# EAGLE board Main_Board_Rev_A2 (EAGLE 7.7.0)
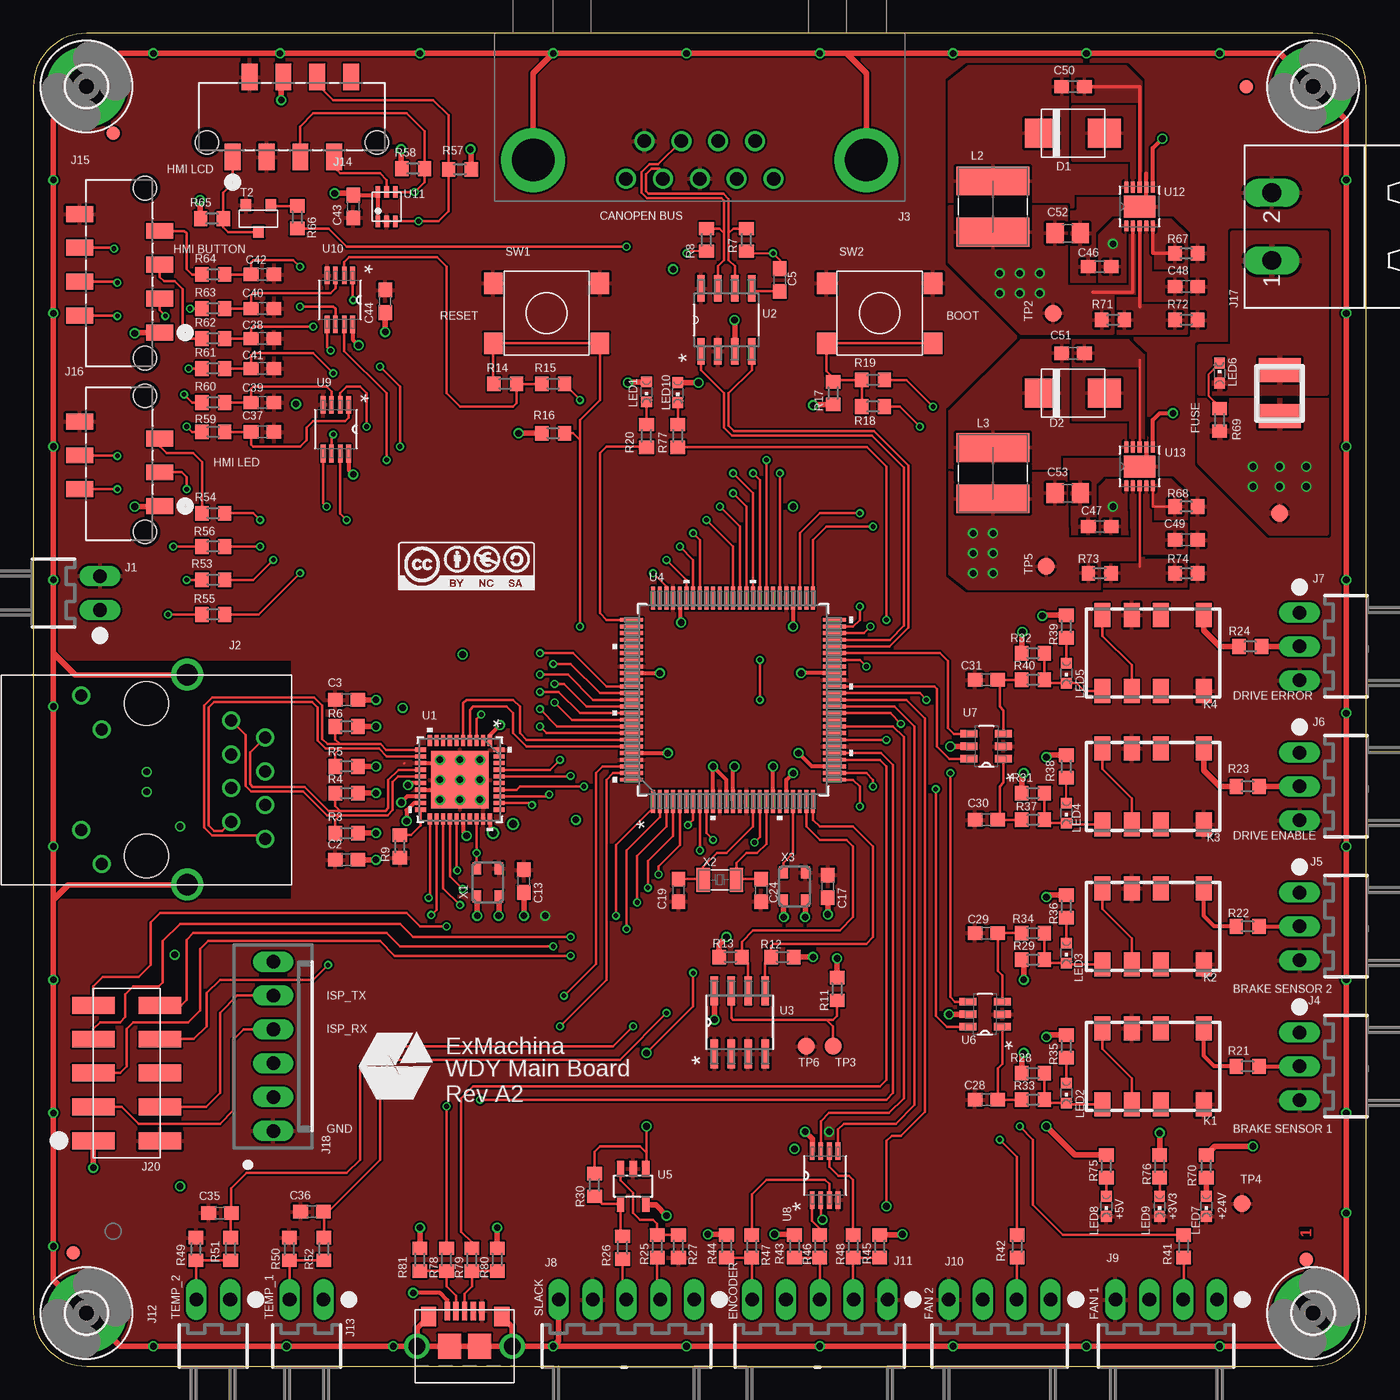
[diagram p6: board, top side]
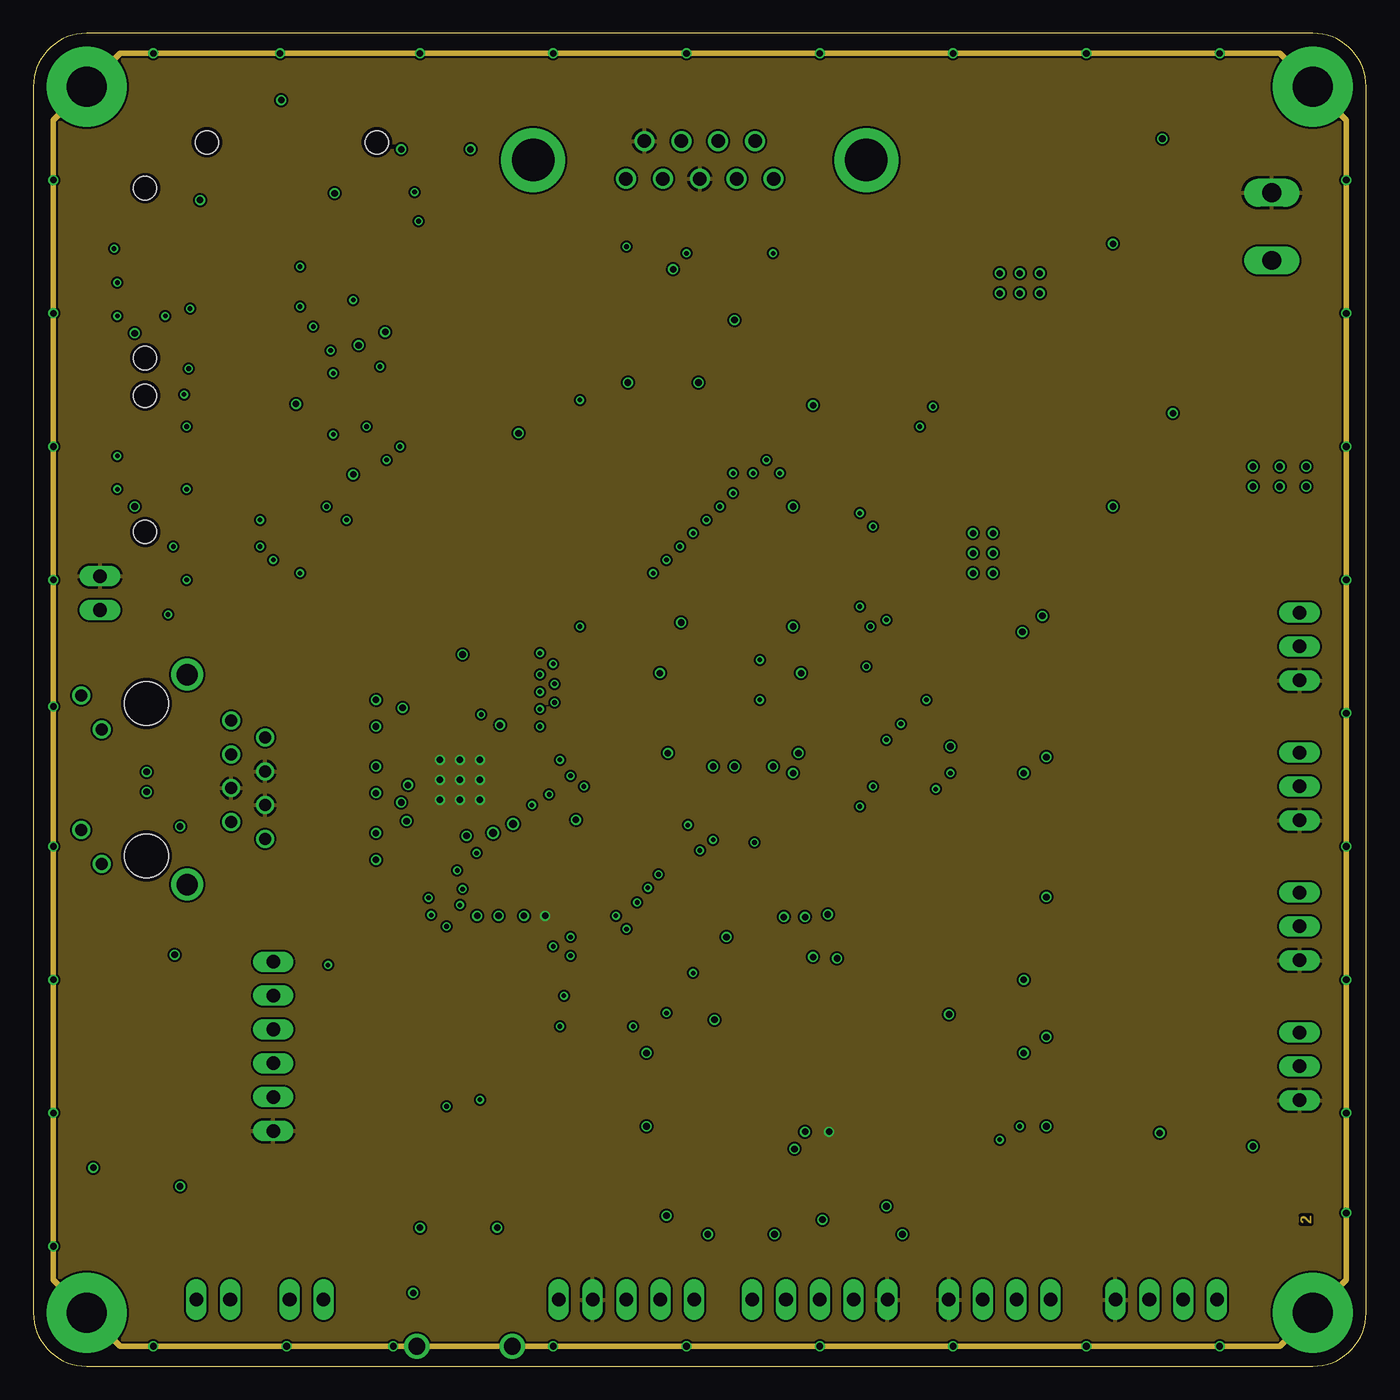
[diagram p7: board, inner layer Route2]
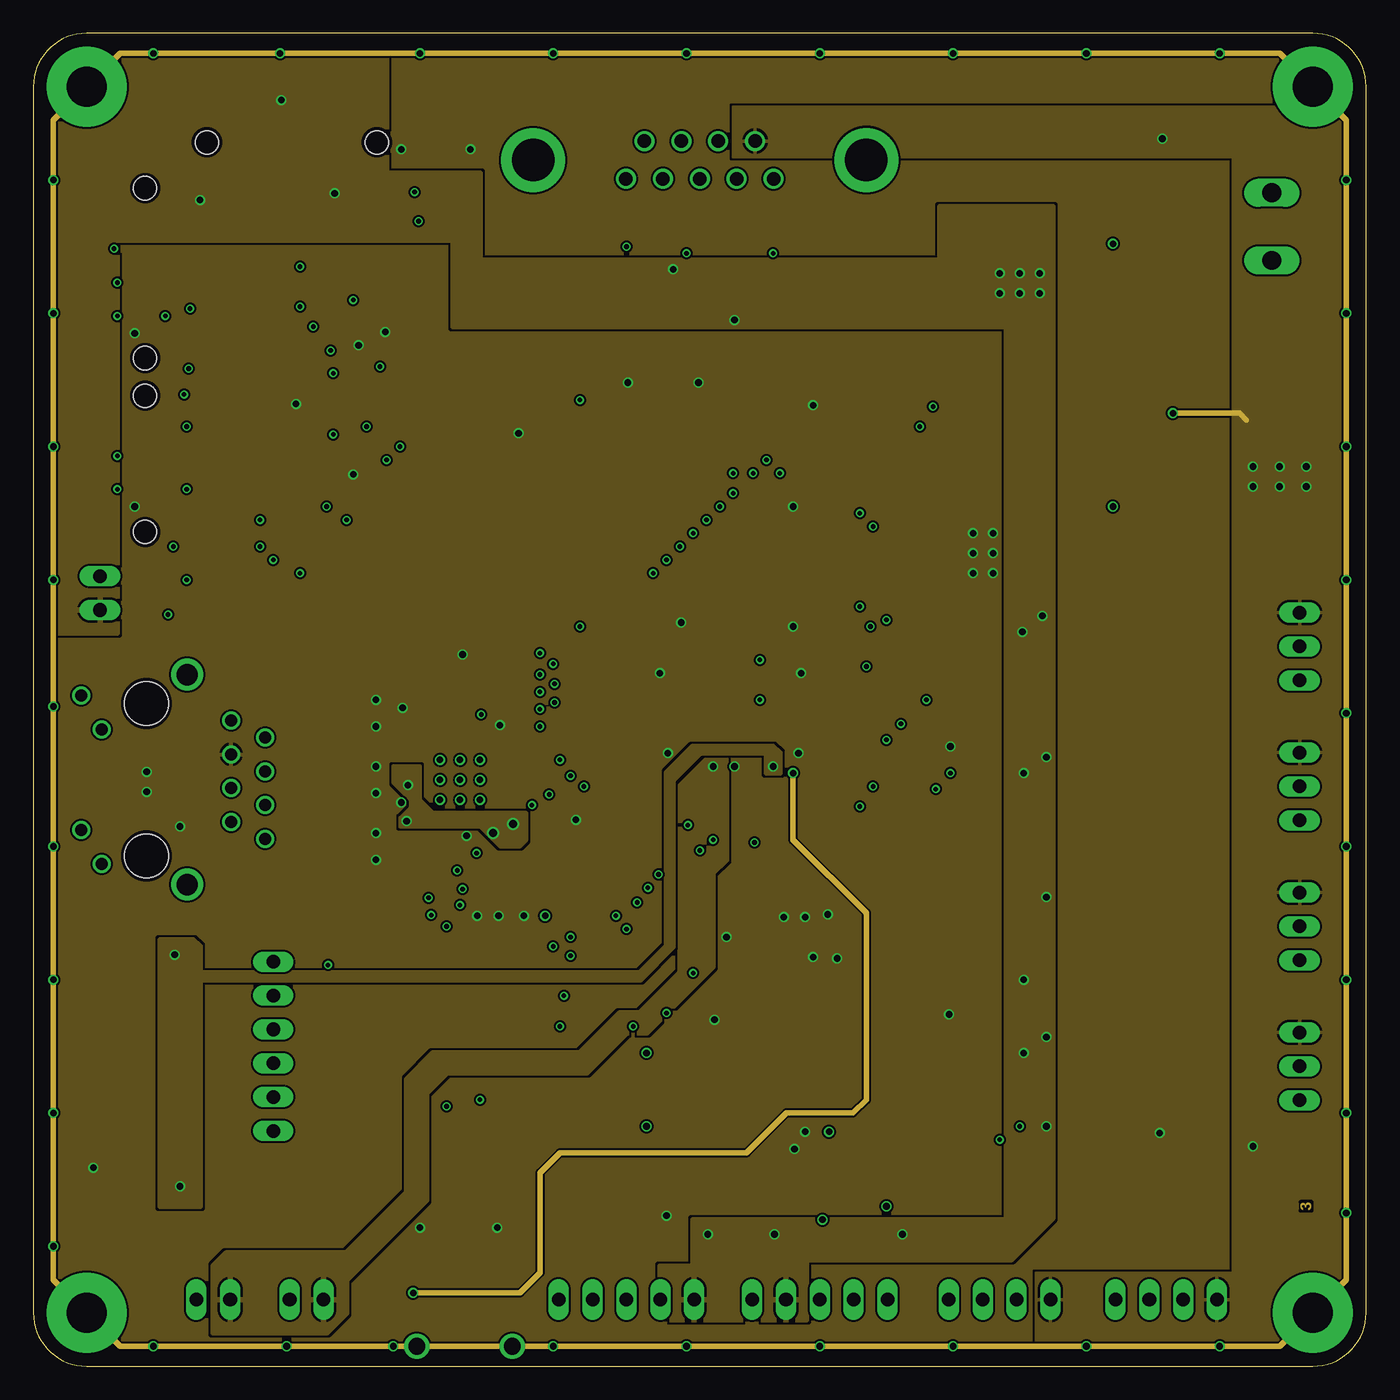
[diagram p8: board, inner layer Route15]
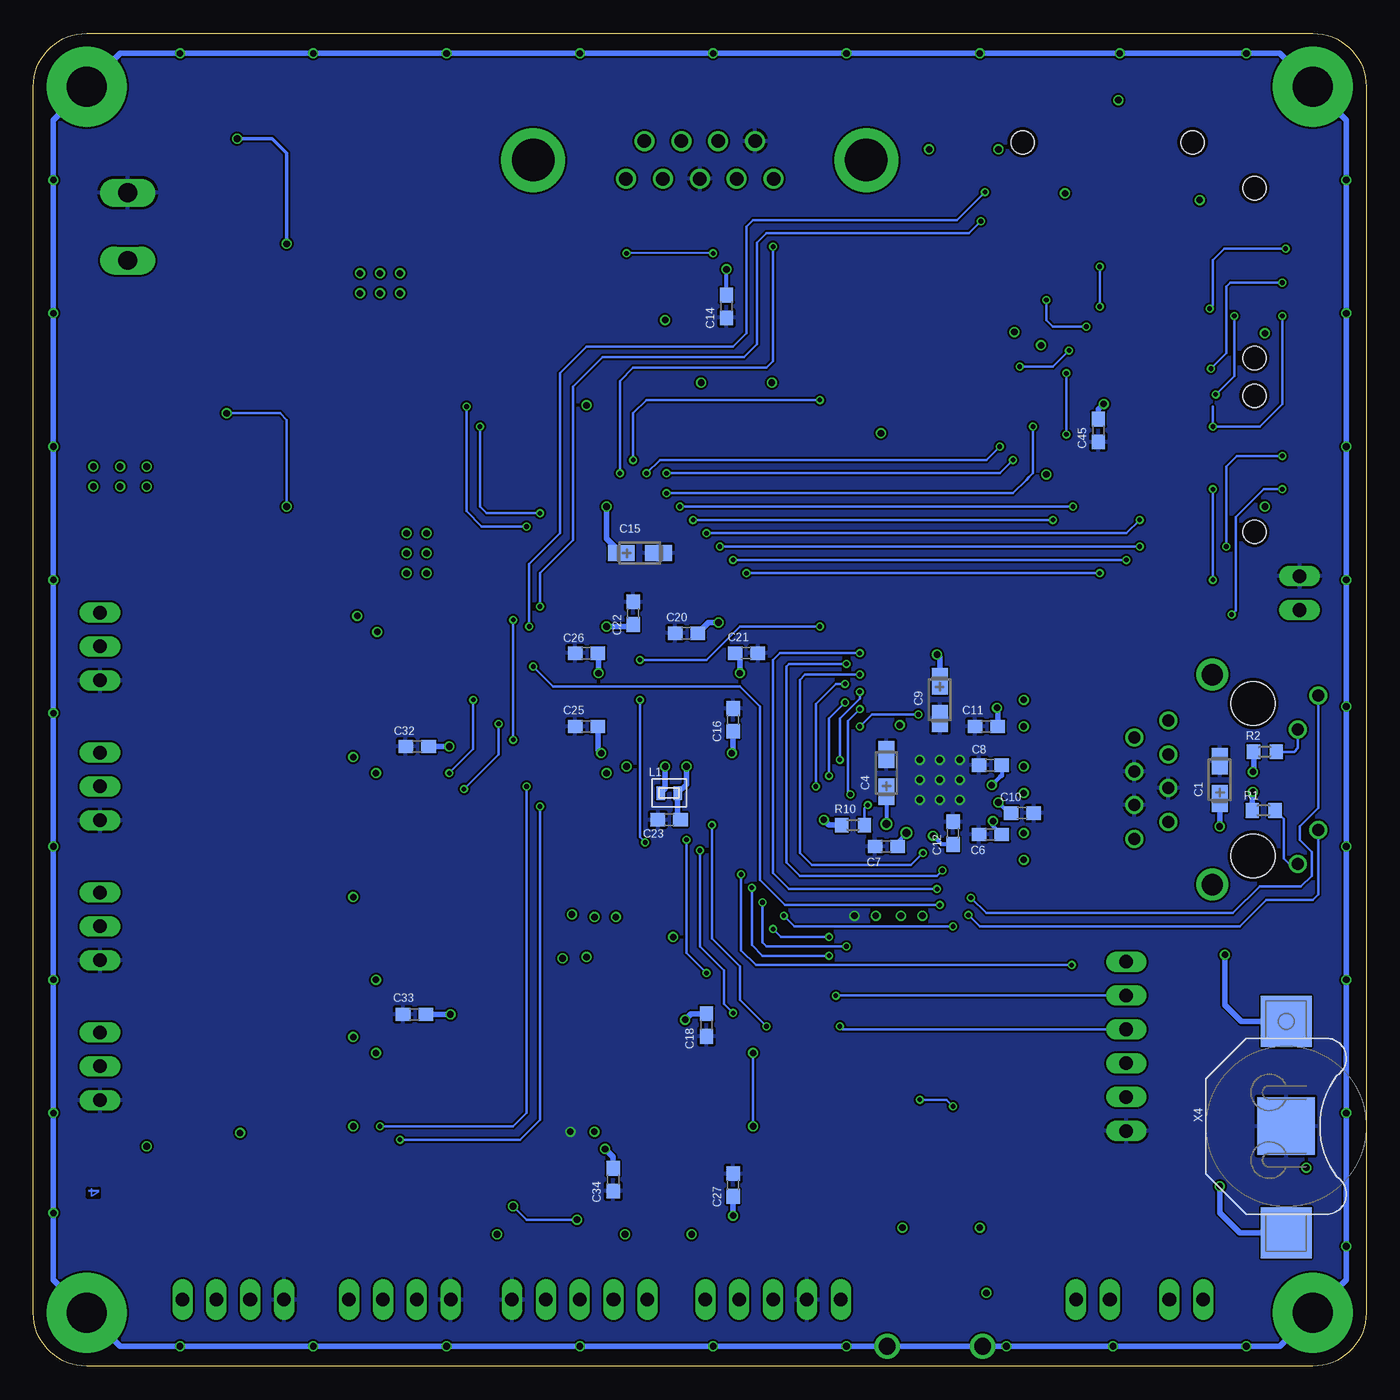
[diagram p9: board, bottom side, seen from below]

Size 100 x 100 mm. Coordinates in mm from the lower left corner, seen from the top.
Outline: 0,96 0,4 arc90 4,0 96,0 arc90 100,4 100,96 arc90 96,100 4,100 arc90 0,96
Copper layers (1+2*15+16): Top 0.018mm / dielectric 0.36mm / Route2 0.035mm / dielectric 0.71mm / Route15 0.035mm / dielectric 0.2mm / Bottom 0.018mm
Design rules "eC_4Layer_PClass6_BaseCopperO18-I35_eCDefault *": minimum track width 0.15mm, minimum drill 0.35mm, track to track 0.15mm, track to pad 0.15mm, pad to pad 0.15mm, via to via 0.15mm, smd to smd 0mil, copper to edge 0.25mm, drill to drill 0.35mm, minimum pad ring 0.175mm, minimum via ring 0.125mm, stop-mask expansion 0mil, vias tented up to drill 0.5mm, thermal gap 0.2mm
Net classes: 1 signal: width 0.178 mm, drill 0.35 mm; 2 supply: width 0.008 mm, drill 0.5 mm

## Footprints (pad centres in the part's own frame; a part is rotated, then mirrored left to right if it is on the bottom)
CT3216 = smd 2 x 1.2: + -1.4,0; - 1.4,0
C0603 = smd 1.1 x 1: 1 -0.85,0; 2 0.85,0
C0805 = smd 1.3 x 1.5: 1 -0.95,0; 2 0.95,0
DO-214AA = smd 2.5 x 2.2: A 2.35,0; C -2.35,0
LITTLEFUSE_SMD = smd 1.78 x 3.15: 1 -1.725,0; 2 1.725,0
7395-02 = drill 1.016 long: 1 1.27,0; 2 -1.27,0
WIZNET_RB1-125BAG1A = drill 0.9: L1 6.325,-3.38; L2 3.784,-4.899; L3 -3.786,-3.379; L4 -6.325,-4.9 | drill 0.9 pad 1.3: R1 -4.446,6.349; R2 -3.176,8.889; R3 -1.906,6.349; R4 -0.636,8.889; R5 0.634,6.349; R6 1.904,8.889; R7 3.174,6.349; R8 4.444,8.889 | drill 1.6 pad 2.184: S1 -7.876,3.049; S2 7.874,3.049 | hole 3.3: 5.714,-0.001; -5.716,-0.001
5504F1-09S-02A = drill 1: 1 -5.54,-1.42; 2 -2.77,-1.42; 3 0,-1.42; 4 2.77,-1.42; 5 5.54,-1.42; 6 -4.155,1.42; 7 -1.385,1.42; 8 1.385,1.42; 9 4.155,1.42 | drill 3.2: G1 -12.495,0; G2 12.495,0
7395-03 = drill 1.016 long: 1 2.54,0; 2 0,0; 3 -2.54,0
7395-05 = drill 1.016 long: 1 5.08,0; 2 2.54,0; 3 0,0; 4 -2.54,0; 5 -5.08,0
7395-04 = drill 1.016 long: 1 3.81,0; 2 1.27,0; 3 -1.27,0; 4 -3.81,0
MOLEX_90814-0208 = smd 1.194 x 2.007: 1 -4.445,-3.175; 2 -3.175,2.819; 3 -1.905,-3.175; 4 -0.635,2.819; 5 0.635,-3.175; 6 1.905,2.819; 7 3.175,-3.175; 8 4.445,2.819 | hole 1.753: -6.375,-2.083; 6.375,-2.083
MOLEX_90814-0206 = smd 1.194 x 2.007: 1 -3.175,-3.175; 2 -1.905,2.819; 3 -0.635,-3.175; 4 0.635,2.819; 5 1.905,-3.175; 6 3.175,2.819 | hole 1.753: -5.105,-2.083; 5.105,-2.083
MSTBA2 = drill 1.397 long: 1 -2.54,5.08; 2 2.54,5.08
6410-06 = drill 1.016 long: 1 6.35,0; 2 3.81,0; 3 1.27,0; 4 -1.27,0; 5 -3.81,0; 6 -6.35,0
USB_MICROB_SMT = smd 0.4 x 1.4: 1 -1.3,2.65; 2 -0.65,2.65; 3 0,2.65; 4 0.65,2.65; 5 1.3,2.65 | smd 1.15 x 1.45: 7 -2.7,2.23; 8 2.8,2.23 | smd 1.75 x 1.9: 9 -1.125,0; 10 1.125,0 | drill 1.25 pad 1.9: 11 -3.575,0; 12 3.575,0
2.54/2X5 = smd 1.27 x 3.2: 1 -5.08,2.5; 2 -5.08,-2.5; 3 -2.54,2.5; 4 -2.54,-2.5; 5 0,2.5; 6 0,-2.5; 7 2.54,2.5; 8 2.54,-2.5; 9 5.08,2.5; 10 5.08,-2.5
FIDUCIAL-1X2 = smd 1 x 1: 1 0,0
G6K-2G-Y = smd 1.2 x 1.8: 1 -3.8,-2.85; 2 -0.6,-2.85; 3 1.6,-2.85; 4 3.8,-2.85; 5 3.8,2.85; 6 1.6,2.85; 7 -0.6,2.85; 8 -3.8,2.85
0603 = smd 0.64 x 1.02: P$1 -0.64,0; P$2 0.64,0
WE-PD2_5848/5820 = smd 2.15 x 5.5: 1 -1.925,0; 2 1.925,0
CHIPLED_0603 = smd 0.8 x 0.8: A 0,-0.75; C 0,0.75
P3,0 = drill 3 pad 6: 1 0,0
R0603 = smd 1 x 1.1: 1 -0.85,0; 2 0.85,0
B3FS = smd 1.4 x 1.6: 1 4,-2.25; 2 -4,-2.25; 3 4,2.25; 4 -4,2.25
SOT−23 = smd 0.787 x 0.889: 1 0.94,1.003; 2 -0.94,1.003; 3 0,-1.003
B1,27 = smd 1.27 x 1.27: TP 0,0
SQA40B = smd 0.813 x 0.305: 1 -2.946,2.25; 2 -2.946,1.75; 3 -2.946,1.25; 4 -2.946,0.75; 5 -2.946,0.25; 6 -2.946,-0.25; 7 -2.946,-0.75; 8 -2.946,-1.25; 9 -2.946,-1.75; 10 -2.946,-2.25; 21 2.946,-2.25; 22 2.946,-1.75; 23 2.946,-1.25; 24 2.946,-0.75; 25 2.946,-0.25; 26 2.946,0.25; 27 2.946,0.75; 28 2.946,1.25; 29 2.946,1.75; 30 2.946,2.25 | smd 0.305 x 0.813: 11 -2.25,-2.946; 12 -1.75,-2.946; 13 -1.25,-2.946; 14 -0.75,-2.946; 15 -0.25,-2.946; 16 0.25,-2.946; 17 0.75,-2.946; 18 1.25,-2.946; 19 1.75,-2.946; 20 2.25,-2.946; 31 2.25,2.946; 32 1.75,2.946; 33 1.25,2.946; 34 0.75,2.946; 35 0.25,2.946; 36 -0.25,2.946; 37 -0.75,2.946; 38 -1.25,2.946; 39 -1.75,2.946; 40 -2.25,2.946 | smd 4.3 x 4.3: 41 0,0
SOIC127P600X175-8N = smd 1.981 x 0.559: 1 -2.362,1.905; 2 -2.362,0.635; 3 -2.362,-0.635; 4 -2.362,-1.905; 5 2.362,-1.905; 6 2.362,-0.635; 7 2.362,0.635; 8 2.362,1.905
SOIC127P600X175-8N' = smd 2.184 x 0.559: 1 -2.362,1.905; 2 -2.362,0.635; 3 -2.362,-0.635; 4 -2.362,-1.905; 5 2.362,-1.905; 6 2.362,-0.635; 7 2.362,0.635; 8 2.362,1.905
SOT407-1 = smd 1.727 x 0.279: 1 -7.62,6; 2 -7.62,5.5; 3 -7.62,5; 4 -7.62,4.5; 5 -7.62,4; 6 -7.62,3.5; 7 -7.62,3; 8 -7.62,2.5; 9 -7.62,2; 10 -7.62,1.5; 11 -7.62,1; 12 -7.62,0.5; 13 -7.62,0; 14 -7.62,-0.5; 15 -7.62,-1; 16 -7.62,-1.5; 17 -7.62,-2; 18 -7.62,-2.5; 19 -7.62,-3; 20 -7.62,-3.5; 21 -7.62,-4; 22 -7.62,-4.5; 23 -7.62,-5; 24 -7.62,-5.5; 25 -7.62,-6; 51 7.62,-6; 52 7.62,-5.5; 53 7.62,-5; 54 7.62,-4.5; 55 7.62,-4; 56 7.62,-3.5; 57 7.62,-3; 58 7.62,-2.5; 59 7.62,-2; 60 7.62,-1.5; 61 7.62,-1; 62 7.62,-0.5; 63 7.62,0; 64 7.62,0.5; 65 7.62,1; 66 7.62,1.5; 67 7.62,2; 68 7.62,2.5; 69 7.62,3; 70 7.62,3.5; 71 7.62,4; 72 7.62,4.5; 73 7.62,5; 74 7.62,5.5; 75 7.62,6 | smd 0.279 x 1.727: 26 -6,-7.62; 27 -5.5,-7.62; 28 -5,-7.62; 29 -4.5,-7.62; 30 -4,-7.62; 31 -3.5,-7.62; 32 -3,-7.62; 33 -2.5,-7.62; 34 -2,-7.62; 35 -1.5,-7.62; 36 -1,-7.62; 37 -0.5,-7.62; 38 0,-7.62; 39 0.5,-7.62; 40 1,-7.62; 41 1.5,-7.62; 42 2,-7.62; 43 2.5,-7.62; 44 3,-7.62; 45 3.5,-7.62; 46 4,-7.62; 47 4.5,-7.62; 48 5,-7.62; 49 5.5,-7.62; 50 6,-7.62; 76 6,7.62; 77 5.5,7.62; 78 5,7.62; 79 4.5,7.62; 80 4,7.62; 81 3.5,7.62; 82 3,7.62; 83 2.5,7.62; 84 2,7.62; 85 1.5,7.62; 86 1,7.62; 87 0.5,7.62; 88 0,7.62; 89 -0.5,7.62; 90 -1,7.62; 91 -1.5,7.62; 92 -2,7.62; 93 -2.5,7.62; 94 -3,7.62; 95 -3.5,7.62; 96 -4,7.62; 97 -4.5,7.62; 98 -5,7.62; 99 -5.5,7.62; 100 -6,7.62
SOT23-DBV = smd 0.55 x 1.2: 1 -0.95,-1.3; 2 0,-1.3; 3 0.95,-1.3; 4 0.95,1.3; 5 -0.95,1.3
SOT95P280X145-6N = smd 1.27 x 0.559: 1 -1.295,0.94; 2 -1.295,0; 3 -1.295,-0.94; 4 1.295,-0.94; 5 1.295,0; 6 1.295,0.94
SOP65P400X130-8N = smd 1.321 x 0.356: 1 -1.829,0.965; 2 -1.829,0.33; 3 -1.829,-0.33; 4 -1.829,-0.965; 5 1.829,-0.965; 6 1.829,-0.33; 7 1.829,0.33; 8 1.829,0.965
SC-70-DCK = smd 0.35 x 0.85: 1 -0.65,-1.1; 2 0,-1.1; 3 0.65,-1.1; 4 0.65,1.1; 5 0,1.1; 6 -0.65,1.1
DFN300X300X80-11N = smd 0.813 x 0.305: 1 -1.448,0.991; 2 -1.448,0.508; 3 -1.448,0; 4 -1.448,-0.508; 5 -1.448,-0.991; 6 1.448,-0.991; 7 1.448,-0.508; 8 1.448,0; 9 1.448,0.508; 10 1.448,0.991 | smd 1.651 x 2.388: 11 0,0
ASE = smd 0.9 x 0.65: 1 -1.05,-0.825; 2 1.05,-0.825; 3 1.05,0.825; 4 -1.05,0.825
FC-135 = smd 1 x 1.8: 1 -1.25,0; 2 1.25,0
3000 = smd 3.81 x 3.81: +1 -7.874,0; +2 8.001,0 | smd 4.318 x 4.318: - 0,0

## Placement (x,y rotation side)
C1  4.7uF  [CT3216]  11,44 90 bottom
C2  100nF  [C0603]  23.5,38 180 top
C3  100nF  [C0603]  23.5,50 180 top
C4  10uF  [CT3216]  36,44.5 90 bottom
C5  4700pF  [C0603]  56,81.5 270 top
C6  100nF  [C0603]  28.2,39.9 180 bottom
C7  100nF  [C0603]  36,39 180 bottom
C8  100nF  [C0603]  28.2,45.1 180 bottom
C9  10uF  [CT3216]  32,50 270 bottom
C10  100nF  [C0603]  25.8,41.5 0 bottom
C11  100nF  [C0603]  28.5,48 180 bottom
C12  100nF  [C0603]  31,40 90 bottom
C13  100nF  [C0603]  36.8,36.4 90 top
C14  100nF  [C0603]  48,79.5 270 bottom
C15  10uF  [CT3216]  54.5,61 0 bottom
C16  0.1uF  [C0603]  47.5,48.5 90 bottom
C17  0.1uF  [C0603]  59.6,36 90 top
C18  0.1uF  [C0603]  49.5,25.6 270 bottom
C19  18pF  [C0603]  48.4,35.7 270 top
C20  0.1uF  [C0603]  51,55 180 bottom
C21  0.1uF  [C0603]  46.5,53.5 0 bottom
C22  0.1uF  [C0603]  55,56.5 90 bottom
C23  0.1uF  [C0603]  52.3,41 180 bottom
C24  18pF  [C0603]  54.6,35.7 270 top
C25  0.1uF  [C0603]  58.5,48 180 bottom
C26  0.1uF  [C0603]  58.5,53.5 180 bottom
C27  0.1uF  [C0603]  47.5,13.6 90 bottom
C28  0.1uF  [C0603]  71.5,20 180 top
C29  0.1uF  [C0603]  71.5,32.5 180 top
C30  0.1uF  [C0603]  71.5,41 180 top
C31  0.1uF  [C0603]  71.5,51.5 180 top
C32  0.1uF  [C0603]  71.2,46.5 180 bottom
C33  0.1uF  [C0603]  71.4,26.4 180 bottom
C34  0.1uF  [C0603]  56.5,14 270 bottom
C35  4.7uF  [C0603]  14,11.5 180 top
C36  4.7uF  [C0603]  20.9,11.6 180 top
C37  0.1uF  [C0603]  17.2,70.1 0 top
C38  0.1uF  [C0603]  17.2,77.1 0 top
C39  0.1uF  [C0603]  17.2,72.3 0 top
C40  0.1uF  [C0603]  17.2,79.35 0 top
C41  0.1uF  [C0603]  17.2,74.85 0 top
C42  0.1uF  [C0603]  17.2,81.9 0 top
C43  0.1uF  [C0603]  24,87 270 top
C44  0.1uF  [C0603]  26.4,79.9 90 top
C45  0.1uF  [C0603]  20.1,70.2 270 bottom
C46  2.2uF  [C0603]  80,82.5 180 top
C47  2.2uF  [C0603]  80,63 180 top
C48  1000pF  [C0603]  86.5,81 0 top
C49  1000pF  [C0603]  86.5,62 0 top
C50  2.2uF  [C0603]  78,96 180 top
C51  2.2uF  [C0603]  78,76 180 top
C52  22uF  [C0805]  77.6,85 0 top
C53  22uF  [C0805]  77.6,65.5 0 top
D1  MBRS140  [DO-214AA]  78,92.5 0 top
D2  MBRS140  [DO-214AA]  78,73 0 top
F1  1812L110/24DR  [LITTLEFUSE_SMD]  93.5,73 270 top
J1  22-05-7028-02  [7395-02]  5,58 270 top
J2  RB1-125BAG1A  [WIZNET_RB1-125BAG1A]  8.5,44 270 top
J3  5504F1-09S-02A-03  [5504F1-09S-02A]  50,90.5 0 top
J4  22-05-7038-03  [7395-03]  95,22.5 90 top
J5  22-05-7038-03  [7395-03]  95,33 90 top
J6  22-05-7038-03  [7395-03]  95,43.5 90 top
J7  22-05-7038-03  [7395-03]  95,54 90 top
J8  22-05-7058-05  [7395-05]  44.5,5 0 top
J9  22-05-7048-04  [7395-04]  85,5 0 top
J10  22-05-7048-04  [7395-04]  72.5,5 0 top
J11  22-05-7058-05  [7395-05]  59.01,5 0 top
J12  22-05-7028-02  [7395-02]  13.5,5 0 top
J13  22-05-7028-02  [7395-02]  20.5,5 0 top
J14  90814-0208  [MOLEX_90814-0208]  19.4,93.9 0 top
J15  90814-0208  [MOLEX_90814-0208]  6.3,82 90 top
J16  90814-0206  [MOLEX_90814-0206]  6.3,67.7 90 top
J17  MSTBA2  [MSTBA2]  98,85.5 90 top
J18  22-27-2061-06  [6410-06]  18,24 270 top
J19  USB3075-30-A  [USB_MICROB_SMT]  32.35,1.5 0 top
J20  1241050-5  [2.54/2X5]  7,22 90 top
JP1  FIDUCIAL1X2  [FIDUCIAL-1X2]  3,8.5 0 top
JP2  FIDUCIAL1X2  [FIDUCIAL-1X2]  95.5,8 0 top
JP3  FIDUCIAL1X2  [FIDUCIAL-1X2]  6,92.5 0 top
JP4  FIDUCIAL1X2  [FIDUCIAL-1X2]  91,96 0 top
K1  G6K-2G-Y  [G6K-2G-Y]  84,22.5 180 top
K2  G6K-2G-Y  [G6K-2G-Y]  84,33 180 top
K3  G6K-2G-Y  [G6K-2G-Y]  84,43.5 180 top
K4  G6K-2G-Y  [G6K-2G-Y]  84,53.5 180 top
L1  0603PS-103KLB  [0603]  52.3,43 0 bottom
L2  15uH  [WE-PD2_5848/5820]  71.99,87 270 top
L3  10uH  [WE-PD2_5848/5820]  71.99,67 270 top
LED1  Blue  [CHIPLED_0603]  46,73.1 180 top
LED2  Blue  [CHIPLED_0603]  77.5,20.5 180 top
LED3  Blue  [CHIPLED_0603]  77.5,31 180 top
LED4  Blue  [CHIPLED_0603]  77.5,41.5 180 top
LED5  Blue  [CHIPLED_0603]  77.5,52 180 top
LED6  Red  [CHIPLED_0603]  89,74.5 0 top
LED7  Blue  [CHIPLED_0603]  88,12 180 top
LED8  Blue  [CHIPLED_0603]  80.5,12 180 top
LED9  Blue  [CHIPLED_0603]  84.5,12 180 top
LED10  Blue  [CHIPLED_0603]  48.35,73.05 180 top
MP1  MOUNT-PAD3,0  [P3,0]  4,96 0 top
MP2  MOUNT-PAD3,0  [P3,0]  96,96 0 top
MP3  MOUNT-PAD3,0  [P3,0]  4,4 0 top
MP4  MOUNT-PAD3,0  [P3,0]  96,4 0 top
R1  220  [R0603]  7.7,41.7 180 bottom
R2  220  [R0603]  7.6,46.1 180 bottom
R3  49.9  [R0603]  23.5,40 180 top
R4  49.9  [R0603]  23.5,43 180 top
R5  49.9  [R0603]  23.5,45 180 top
R6  49.9  [R0603]  23.5,48 180 top
R7  60.4  [R0603]  53.5,84.5 270 top
R8  60.4  [R0603]  50.5,84.5 90 top
R9  4K7  [R0603]  27.5,39 270 top
R10  2K2  [R0603]  38.5,40.6 0 bottom
R11  10K  [R0603]  60.3,28.3 90 top
R12  4K7  [R0603]  56.2,30.7 0 top
R13  4K7  [R0603]  52.3,30.7 180 top
R14  0R  [R0603]  35.4,73.7 0 top
R15  0R  [R0603]  39,73.7 0 top
R16  10K  [R0603]  39,70 180 top
R17  10K  [R0603]  60,73 270 top
R18  0R  [R0603]  63,72 180 top
R19  0R  [R0603]  63,74 180 top
R20  1K5  [R0603]  46,69.8 270 top
R21  100  [R0603]  91.1,22.5 180 top
R22  100  [R0603]  91.1,33 180 top
R23  100  [R0603]  91.1,43.5 180 top
R24  100  [R0603]  91.3,54 180 top
R25  60.4  [R0603]  46.8,9 90 top
R26  60.4  [R0603]  44.2,8.9 90 top
R27  374K  [R0603]  48.4,9 90 top
R28  4K7  [R0603]  75,22 0 top
R29  4K7  [R0603]  75,30.5 0 top
R30  374K  [R0603]  42.1,13.6 270 top
R31  4K7  [R0603]  75,43 0 top
R32  4K7  [R0603]  75,53.5 0 top
R33  100  [R0603]  75,20 180 top
R34  100  [R0603]  75,32.5 180 top
R35  1K5  [R0603]  77.5,24 90 top
R36  1K5  [R0603]  77.5,34.5 90 top
R37  100  [R0603]  75,41 180 top
R38  1K5  [R0603]  77.5,45 90 top
R39  1K5  [R0603]  77.5,55.5 90 top
R40  100  [R0603]  75,51.5 180 top
R41  1K  [R0603]  86.3,9 90 top
R42  1K  [R0603]  73.8,9 90 top
R43  2K7  [R0603]  57.11,9 270 top
R44  2K7  [R0603]  52.01,9 270 top
R45  2K7  [R0603]  63.51,9 270 top
R46  1K  [R0603]  59.01,9 90 top
R47  1K  [R0603]  53.91,9 90 top
R48  1K  [R0603]  61.51,9 90 top
R49  10K  [R0603]  12.2,8.8 270 top
R50  10K  [R0603]  19.2,8.8 90 top
R51  10K  [R0603]  14.8,8.8 270 top
R52  10K  [R0603]  21.8,8.8 90 top
R53  100  [R0603]  13.5,59 0 top
R54  100  [R0603]  13.5,64 0 top
R55  100  [R0603]  13.5,56.4 180 top
R56  100  [R0603]  13.5,61.5 180 top
R57  4K7  [R0603]  32,89.8 180 top
R58  4K7  [R0603]  28.5,89.85 0 top
R59  1K  [R0603]  13.5,70.1 0 top
R60  1K  [R0603]  13.5,72.3 0 top
R61  1K  [R0603]  13.5,74.85 0 top
R62  1K  [R0603]  13.5,77.1 0 top
R63  1K  [R0603]  13.5,79.35 0 top
R64  1K  [R0603]  13.5,81.9 0 top
R65  100  [R0603]  13.4,86.1 0 top
R66  100  [R0603]  19.8,86.2 270 top
R67  31K6  [R0603]  86.5,83.5 180 top
R68  31K6  [R0603]  86.5,64.5 180 top
R69  4K7  [R0603]  89,71 270 top
R70  4K7  [R0603]  88,15 90 top
R71  52K3  [R0603]  81,78.5 180 top
R72  10K  [R0603]  86.5,78.5 180 top
R73  31K6  [R0603]  80,59.5 180 top
R74  10K  [R0603]  86.5,59.5 180 top
R75  1K5  [R0603]  80.5,15 90 top
R76  1K5  [R0603]  84.5,15 90 top
R77  1K5  [R0603]  48.35,69.8 270 top
R78  33  [R0603]  31,8 90 top
R79  33  [R0603]  32.9,8 90 top
R80  1K5  [R0603]  34.8,8 270 top
R81  1K5  [R0603]  29,8 270 top
SW1  B3FS-1050  [B3FS]  38.5,79 180 top
SW2  B3FS-1050  [B3FS]  63.5,79 180 top
T1  EXMACHINA-LOGO-NAME  [EXM-LOGO-BASELINE]  27.11,22.49 0 top
T2  MMBT2222AL  [SOT−23]  16.9,86.1 0 top
TP1  TPB1,27  [B1,27]  93.5,64 90 top
TP2  TPB1,27  [B1,27]  76.5,79 90 top
TP3  TPB1,27  [B1,27]  60,24 0 top
TP4  TPB1,27  [B1,27]  90.7,12.2 180 top
TP5  TPB1,27  [B1,27]  76,60 90 top
TP6  TPB1,27  [B1,27]  58,24 0 top
U1  DP83848JSQ/NOPB  [SQA40B]  32,44 270 top
U2  MCP2561-E/SN  [SOIC127P600X175-8N]  52,78.5 90 top
U3  AT24C512C-SSHM-B  [SOIC127P600X175-8N']  53,25.8 90 top
U4  LPC1768FBD100  [SOT407-1]  52.5,50 90 top
U5  TLV313  [SOT23-DBV]  45,13.5 180 top
U6  SN74LVC2G17DBVR  [SOT95P280X145-6N]  71.4,26.4 180 top
U7  SN74LVC2G17DBVR  [SOT95P280X145-6N]  71.5,46.5 180 top
U8  SN74LVC3G17DCTR  [SOP65P400X130-8N]  59.41,14.3 90 top
U9  SN74LVC3G17DCTR  [SOP65P400X130-8N]  22.7,70.3 270 top
U10  SN74LVC3G17DCTR  [SOP65P400X130-8N]  23,80 270 top
U11  TPL0401A  [SC-70-DCK]  26.5,87 0 top
U12  LT3686HDDPBF  [DFN300X300X80-11N]  83,87 90 top
U13  LT3686HDDPBF  [DFN300X300X80-11N]  83,67.5 90 top
U$1  [CC-BY-NC-SA]  32.5,60 0 top
X1  ASE_50  [ASE]  34.1,36.3 90 top
X2  FC-135  [FC-135]  51.5,36.5 0 top
X3  ASE-12  [ASE]  57.1,36 90 top
X4  3000  [3000]  6,18 270 bottom

## Tracks (layer width: path | path; a pad name or v marks a point on that pad's centre or on a via)
!JTAG_TRST  (via drill 0.35)
  Top 0.178: U4.4 48,39.8 46.1,37.9 v46.1,35.9 | v40.3,30.8 27.1,30.8 26,31.9 13.1,31.9 12.5,31.3 12.5,26.7 11.6,25.8 7.5,25.8 7,25.3 7,22.5 6.5,22 J20.5
  Bottom 0.178: v40.3,30.8 45.3,30.8 46.1,31.6 v46.1,35.9
!RESET  (via drill 0.35)
  Top 0.178: v54.1,39.3 54.5,39.7 U4.17 | R14.1 34.5,73.75 SW1.3 SW1.4 42.5,72.5 41,71 41,69.5 | 41,69.5 v41,55.5 | v54.5,53 v54.5,50 | R16.1 40.5,70 41,69.5
  Bottom 0.178: v54.5,50 54.5,39.7 v54.1,39.3 | v41,55.5 47,55.5 49.5,53 v54.5,53
+3V3  (via drill 0.5)
  Top 0.305: U1.1 34.25,47.35 v35,48.1 | U1.26 32.25,40.05 v32.5,39.8 | U1.18 28.05,42.75 v27.6,42.3 | U4.71 48.5,55.9 v48.6,55.8 | U4.54 v57,55.5 | U4.42 v57.6,52 | U4.84 v47,52 | U4.13 52.5,44.9 v52.6,45 | U4.28 58.4,45 v57.4,46 | U4.96 v47.6,46 | U10.8 23.96,77.03 v24.4,76.6 | U9.8 23.66,67.23 v24,66.9
  Top 0.406: C44.1 v26.4,77.6 | R58.1 27.6,89.9 v27.6,91.3 | R57.1 32.85,91.25 arc90 v32.8,91.3 | LED1.A 44.65,73.85 v44.6,73.8 | LED10.A v49.9,73.8 | R17.2 58.55,72.15 v58.5,72.1 | U7.5 v68.8,46.5 | U6.5 v68.7,26.4 | U5.5 46.05,12.1 46.7,12.1 v47.5,11.3 | R80.1 v34.8,10.4 | U8.8 58.44,17.07 v57.91,17.6 | U3.8 v51.09,26 v51.1,26 | R13.2 51.45,31.65 v52,32.2 | R12.2 v58.5,30.7 | X1.4 33.27,33.83 v33.3,33.8 | X1.1 34.92,33.83 v34.9,33.8 | C13.1 v36.8,33.8 | C2.1 v25.7,38 | R3.1 v25.7,40 | R4.1 v25.7,43 | R5.1 v25.7,45 | R6.1 v25.7,48 | C3.1 v25.7,50 | v56.3,33.7 56.27,33.73 X3.4 | v57.9,33.7 57.92,33.73 X3.1 | v59.6,33.9 C17.1 | 4.5,17 J20.1 v4.5,14.9 | R76.2 v84.5,17.5 | v7.6,64.5 9.45,64.5 J16.1 | v7.6,77.5 7.66,77.56 J15.1 | R11.2 v60.3,30.6 | R81.1 v29,10.4 | R16.2 v36.4,70
  Bottom 0.305: C10.1 26.9,41.5 26.9,41.6 v27.6,42.3 | C12.1 31.85,39.15 v32.5,39.8
  Bottom 0.406: v19.7,72.2 20.1,71.8 C45.1 | C32.1 v68.8,46.5 | C33.1 v68.7,26.4 | C27.1 v47.5,11.3 | C18.1 50.65,26.45 v51.1,26 | C11.1 27.65,49.35 v27.7,49.4 | C9.+ 32,53.2 v32.2,53.4 | L1.P$1 52.6,43.34 v52.6,45 | C21.1 47,53.15 v47,52 | C20.1 49.35,55.8 v48.6,55.8 | C22.1 55.15,55.5 v57,55.5 | C26.1 57.6,53.45 v57.6,52 | v57.4,46 57.65,46.25 C25.1 | v47.6,46 47.5,46.1 C16.1 | C15.+ 57,62.1 v57,64.5 | v11,40.5 C1.+ | R1.2 8.55,43.05 v8.5,43.1 | R2.2 8.45,44.65 v8.5,44.6 | R10.1 40.3,40.6 v40.7,41 | C34.1 56.5,15.69 v57.11,16.3
  other vias: 70.5,62.5 70.5,61 72,62.5 72,61 72,59.5 70.5,59.5
  pour Route15 (rank 6): -10.5,111.5 136,111.5 135.5,-4 -11,-4
  pour Top: 80,58.3 70.14,58.3 68.75,59.44 68.75,67.1 77.5,67 77.6,62.1 82.4,62.1 82.3,66.5 82.7,66.5 82.7,60.5 80,60.5
+5V  (via drill 0.5)
  Top 0.254: U12.2 82.49,80.6 79.5,80.6
  Top 0.305: U11.1 U11.6 25.6,87.85 C43.1
  Top 0.406: U2.3 52.63,78.47 v52.6,78.5 | v22.6,88 23.85,88 C43.1 | R28.1 74.15,23.35 v74.3,23.5 | R35.2 76.15,24.85 v76,24.7 | R31.1 74.15,44.35 v74.3,44.5 | R38.2 76.15,45.85 v76,45.7 | R32.1 74.15,55.05 v74.2,55.1 | R39.2 75.75,56.35 v75.7,56.3 | v74.3,29 74.3,30.35 R29.1 | R36.2 76.15,35.35 v76,35.2 | v50.61,9.9 51.96,9.9 R44.1 | v55.61,9.9 57.06,9.9 R43.1 | R45.1 65.16,9.85 v65.21,9.9 | R75.2 78.15,15.85 v76,18 | J14.4 18.6,96.55 v18.6,95 | R65.1 12.5,86.15 v12.5,87.5
  Bottom 0.305: C14.1 v48,82.3
  other vias: 72.5,82 74,82 75.5,82 72.5,80.5 74,80.5 75.5,80.5
  pour Route15: -2.5,104.5 26.5,104.5 26.5,89.5 33.5,89.5 33.5,83 68,83 68,87 76.5,87 76.5,11.14 73.36,8 58,8 58,3.5 47,3.5 47,7.5 49.5,7.5 49.5,11 73,11 73,78 31.5,78 31.5,84.5 6.3,84.5 6.3,55 -2.5,55
  pour Top: 82.3,86.1 82.7,86.1 82.7,80.5 81,80.5 81,77.5 74.08,77.5 68.75,82.83 68.75,87 77.5,87 77.5,81 82.3,81
+24V  (via drill 0.5)
  Top 0.305: U12.6 83.99,91.39 v84.7,92.1 | U13.6 83.99,70.99 84.5,71.5 v85.5,71.5
  Top 0.406: R70.2 88.65,16.5 v91.5,16.5
  Route15 0.406: v85.5,71.5 90.5,71.5 91,71
  Bottom 0.178: v85.5,71.5 81.5,71.5 81,71 v81,64.5
  Bottom 0.254: v81,84.2 81,91 82.1,92.1 v84.7,92.1
  other vias: 91.5,67.5 93.5,67.5 93.5,66 91.5,66 95.5,67.5 95.5,66
  pour Route15: 52.5,94.5 98.5,94.5 98.5,0.5 75.2,0.5 75.2,7 90,7 90,90.7 52.5,90.7
  pour Top (rank 2): 80,84 80,81.5 80,81 82,81 82.3,81 82.3,86 81.14,86 80,84.86
  pour Top (rank 2): 80,62.1 80,66 80.5,66.5 82.2,66.5 82.2,62.1
  pour Top (rank 2): 87.5,73 97,73 97,62.5 92.83,62.5 87.5,67.83
ADC_SLACK_DETECTION  (via drill 0.35, 0.5)
  Top 0.178: R30.1 42.1,16.1 42.5,16.5 45.5,16.5 46,16 | 46,16 46,14.85 U5.1 | U4.9 50.5,40 v51,39.5 | v46,23.5 49.5,27 v49.5,29.5 | v46,18 46,16
  Bottom 0.178: v49.5,29.5 51,31 v51,39.5 | v46,23.5 v46,18
ADC_TEMP_0  (via drill 0.35)
  Top 0.178: R51.1 14.8,11.45 C35.1 14.85,13.35 16,14.5 23.5,14.5 24.5,15.5 24.5,22.5 26,24 43.5,24 v45,25.5 | U4.7 49.5,41 v49.1,40.6
  Bottom 0.178: v45,25.5 47,27.5 47,30 49.1,32.1 v49.1,40.6
ADC_TEMP_1  (via drill 0.35)
  Top 0.178: R52.2 21.8,11.55 C36.1 22.1,11.6 26,15.5 26,22 27,23 44,23 v47.5,26.5 | U4.8 v50,38.7
  Bottom 0.178: v50,38.7 50,31.5 48.2,29.7 48.2,27.2 v47.5,26.5
AGND  (via drill 0.5, 0.5 pad 0.41)
  Top 0.406: 1.5,35 v1.5,29 v1.5,19 v1.5,9 1.5,6.5 MP3.1 6.5,1.5 v9,1.5 v19,1.5 v27,1.5 J19.11 | 1.5,35 v1.5,39 v1.5,49.5 1.5,53.5 | 1.5,53.5 v1.5,59 v1.5,69 v1.5,79 v1.5,89 1.5,93.5 MP1.1 6.5,98.5 v9,98.5 v18.5,98.5 v29,98.5 v39,98.5 | v39,98.5 v49,98.5 v59,98.5 61,98.5 | 61,98.5 v69,98.5 v79,98.5 v89,98.5 93.5,98.5 MP2.1 98.5,93.5 v98.5,89 v98.5,79 v98.5,69 v98.5,59 v98.5,49 v98.5,39 v98.5,29 v98.5,19 v98.5,11.5 98.5,6.5 MP4.1 93.5,1.5 v89,1.5 v79,1.5 v69,1.5 v59,1.5 v49,1.5 v39,1.5 | 1.5,53.5 3.13,51.87 J2.S1 | 1.5,35 2.62,36.12 J2.S2 | J19.11 J19.9 J19.10 J19.12 35.92,2.96 J19.8 | 36,1.5 v39,1.5 | J19.7 28.77,2.85 J19.11 | J3.G1 37.51,97 v39,98.5 | J3.G2 62.49,97 61,98.5 | J8.5 39.42,1.92 v39,1.5
  Route2 0.406: 1.5,93.5 6.5,98.5 93.5,98.5 98.5,93.5 v98.5,11.5 98.5,6.5 93.5,1.5 6.5,1.5 1.5,6.5 1.5,93.5
  Route15 0.406: 1.5,6.5 6.5,1.5 v79,1.5 93.5,1.5 98.5,6.5 v98.5,11.5 98.5,93.5 93.5,98.5 6.5,98.5 1.5,93.5 1.5,6.5
  Bottom 0.406: MP4.1 93.5,1.5 v89,1.5 v79,1.5 v69,1.5 v59,1.5 v49,1.5 v39,1.5 v27,1.5 v19,1.5 v9,1.5 6.5,1.5 MP3.1 1.5,6.5 v1.5,9 v1.5,19 v1.5,29 v1.5,39 v1.5,49.5 v1.5,59 v1.5,69 v1.5,79 v1.5,89 1.5,93.5 MP1.1 6.5,98.5 v9,98.5 v18.5,98.5 v29,98.5 v39,98.5 v49,98.5 v59,98.5 v69,98.5 v79,98.5 v89,98.5 93.5,98.5 MP2.1 98.5,93.5 v98.5,89 v98.5,79 v98.5,69 v98.5,59 v98.5,49 v98.5,39 v98.5,29 v98.5,19 v98.5,11.5 98.5,7.5 98.5,6.5 MP4.1
AVDD  (via drill 0.5)
  Top 0.305: U4.12 52,44 v51,45 U4.10
  Bottom 0.406: C23.1 51.66,41.21 L1.P$2 51,43.66 v51,45
  pour Route15 (rank 2): 22,2.5 13.5,2.5 13.5,7.5 14.5,8.5 23.5,8.5 28,13 28,21.5 30,23.5 41,23.5 44,26.5 45.5,26.5 48.5,29.5 48.5,43.5 50.5,45.5 52,45.5 52,38 51,37 51,30 46,25 44.5,25 41.5,22 31,22 29.5,20.5 29.5,12.5 23.5,6.5 23.5,4
BOOT_SELECT_P2_10  (via drill 0.35)
  Top 0.178: U4.53 57.5,62.5 59,64 v62,64 | v66.5,70.5 65,72 R18.1
  Bottom 0.178: v62,64 66,64 66.5,64.5 v66.5,70.5
BOOT_SELECT_P2_12  (via drill 0.35)
  Top 0.178: R19.1 65.5,74 v67.5,72 | v63,63 59.5,63 58.5,62 U4.51
  Bottom 0.178: v67.5,72 67.5,64.14 66.36,63 v63,63
BRAKE_SENSOR_1  (via drill 0.35)
  Top 0.178: U6.6 68.54,25.46 67.7,26.3 v67.7,43.3 | U4.36 64.3,49 v65.1,48.2
  Bottom 0.178: v65.1,48.2 65.1,45.9 v67.7,43.3
BRAKE_SENSOR_2  (via drill 0.35)
  Top 0.178: U4.39 66.5,50.5 v67,50 | v68.8,44.5 68.8,27.7 69.16,27.34 U6.4
  Bottom 0.178: v67,50 67,46.3 v68.8,44.5
CAN_N
  Top 0.178: 52.16,85 52.16,83 52.63,82.53 U2.6 | R7.1 52.51,85.35 52.16,85 | 52.16,85 52.16,87.57 51.77,87.96 46.17,87.96 45.96,88.17 45.96,89.43 46.37,89.84 46.96,89.84 47.23,89.57 J3.2
CAN_P
  Top 0.178: 51.84,85 51.84,83 51.37,82.53 U2.7 | R8.2 51.49,85.35 51.84,85 | J3.7 46.86,90.16 46.23,90.16 45.64,89.57 45.64,88.03 46.03,87.64 51.63,87.64 51.84,87.43 51.84,85
CAN_SPLIT
  Top 0.178: U2.5 54.12,80.65 C5.2
CAN_X_N
  Top 0.178: U4.46 64.23,54 65.66,55.43 65.66,67.57 63.07,70.16 52.57,70.16 52.16,70.57 52.16,73 53.91,74.74 U2.4
CAN_X_P
  Top 0.178: U4.47 64.27,54.5 65.34,55.57 65.34,67.43 62.93,69.84 52.43,69.84 51.84,70.43 51.84,73 50.09,74.74 U2.1
DRIVE_EN
  Top 0.178: U4.40 67.6,51 67.8,50.8 67.8,46.5 68.74,45.56 U7.6
DRIVE_ERR
  Top 0.178: U4.45 68,53.5 68.6,52.9 68.6,47.9 69.06,47.44 U7.4
EEPROM_SCL
  Top 0.178: U4.24 58,40.5 59,39.5 61,39.5 61.5,39 61.5,33.7 60.5,32.7 54,32.7 53.15,31.85 R13.1 53.63,30.21 U3.6
EEPROM_SDA
  Top 0.178: U4.25 58.5,41 59,40.5 61.5,40.5 63,39 63,32.2 62.5,31.7 55.5,31.7 55.35,31.55 R12.1 54.91,30.25 U3.5
ENCODER_A
  Top 0.178: U8.7 59.08,18.37 59.71,19 64.2,19 65.3,20.1 65.3,47.2 64.5,48 U4.34
ENCODER_B
  Top 0.178: U8.5 60.37,17.77 60.81,18.2 64.7,18.2 66.1,19.6 66.1,48 64.6,49.5 U4.37
ENCODER_Z  (via drill 0.5)
  Top 0.178: U8.2 59.08,11.13 v59.21,11 | v64.01,12 64.01,16.9 64.41,17.3 65.1,17.3 66.9,19.1 66.9,48.6 65.5,50 U4.38
  Bottom 0.178: v59.21,11 63.01,11 v64.01,12
ETH_CRS  (via drill 0.35)
  Top 0.178: U4.92 39.3,48 v38,49.3 | U1.33 38.55,42.75 v38.7,42.9
  Bottom 0.178: v38.7,42.9 38.9,43.1 38.9,48.4 v38,49.3
ETH_MDC  (via drill 0.35)
  Top 0.178: v39,52.7 40.3,52.7 42.5,50.5 U4.87 | v31.8,37.2 31.75,37.25 U1.25
  Bottom 0.178: v39,52.7 43.3,52.7 43.5,52.5 43.5,37.8 42.5,36.8 32.2,36.8 v31.8,37.2
ETH_MDIO  (via drill 0.35)
  Top 0.178: v38,53.5 40.5,53.5 43,51 U4.86 | U1.24 31.25,36.75 v32.2,35.8
  Bottom 0.178: v38,53.5 44,53.5 44.5,53 44.5,37 43.3,35.8 v32.2,35.8
ETH_RST  (via drill 0.35)
  Top 0.178: U1.23 30.75,35.85 v32,34.6 | U4.44 62,53 v62.5,52.5
  Bottom 0.178: v32,34.6 43.6,34.6 45.5,36.5 45.5,49.5 47,51 61,51 v62.5,52.5
ETH_RX_ER  (via drill 0.35)
  Top 0.178: U4.89 41.5,49.5 39.8,51.2 v39.1,51.2 | U1.34 36.25,43.25 36.5,43.5 v41.3,43.5
  Bottom 0.178: v41.3,43.5 41.3,49.7 39.8,51.2 v39.1,51.2
ETH_RX_N
  Top 0.178: U1.11 26.48,46.25 26.07,46.66 23,46.66 | R6.2 22.65,47.01 23,46.66 | J2.R8 17.11,39.84 13.43,39.84 12.84,40.43 12.84,49.57 13.43,50.16 21.07,50.16 21.66,49.57 21.66,47.07 22.07,46.66 23,46.66
ETH_RX_P
  Top 0.178: U1.12 26.52,45.75 25.93,46.34 23,46.34 | R5.2 22.65,45.99 23,46.34 | J2.R7 14.19,40.16 13.57,40.16 13.16,40.57 13.16,49.43 13.57,49.84 20.93,49.84 21.34,49.43 21.34,46.93 21.93,46.34 23,46.34
ETH_RXD_0  (via drill 0.35)
  Top 0.178: U4.91 40.4,48.5 v39.1,49.8 | U1.36 40.25,44.25 v40.3,44.3
  Bottom 0.178: v40.3,44.3 40.3,48.6 v39.1,49.8
ETH_RXD_1  (via drill 0.35)
  Top 0.178: U4.90 41,49 39.4,50.6 v38,50.6 | U1.37 38.75,44.75 v39.5,45.5
  Bottom 0.178: v39.5,45.5 39.5,48.6 38,50.1 v38,50.6
ETH_TX_N
  Top 0.178: U1.14 27.42,44.75 26.64,43.97 26.64,41.87 26.43,41.66 23,41.66 | 23,41.66 22.17,41.66 20.37,43.46 16.47,43.46 16.26,43.67 16.26,46.05 J2.R2 | R4.2 22.65,42.01 23,41.66
ETH_TX_P
  Top 0.178: U1.15 27.38,44.25 26.96,43.83 26.96,41.73 26.57,41.34 23,41.34 | 23,41.34 22.03,41.34 20.23,43.14 16.33,43.14 15.94,43.53 15.94,47.36 J2.R1 | R3.2 22.65,40.99 23,41.34
ETH_TXD_0
  Top 0.178: U1.4 32.75,49.25 33,49.5 35.5,49.5 36,49 36,47.5 37,46.5 U4.95
ETH_TXD_1
  Top 0.178: U1.5 32.25,49.75 32.5,50 35,50 35.5,50 36,50 36.5,49.5 36.5,47.5 37,47 U4.94
ETH_TXD_EN  (via drill 0.35)
  Top 0.178: U4.93 38.5,47.5 v38,48 | U1.3 33.25,48.55 v33.6,48.9
  Bottom 0.178: v33.6,48.9 37.1,48.9 v38,48
ETH_X1  (via drill 0.35)
  Top 0.178: v38,51.9 40.1,51.9 42,50 U4.88 | U1.28 v33.25,38.5 33.25,37.38 X1.3
  Bottom 0.178: v38,51.9 42.1,51.9 42.5,51.5 42.5,38.5 41.6,37.6 34.15,37.6 v33.25,38.5
FAN_1_PWM  (via drill 0.35)
  Top 0.178: U4.27 62.5,44.5 63,44 v63,43.5 | v74,18 75,17 75,12.1 77.25,9.85 R41.2
  Bottom 0.178: v63,43.5 63,19 64,18 v74,18
FAN_2_PWM  (via drill 0.35)
  Top 0.178: R42.2 73.8,15.7 v72.5,17 | v62,42 62,43.5 61.5,44 U4.26
  Bottom 0.178: v72.5,17 63.5,17 62,18.5 v62,42
GND  (via drill 0.5)
  Top 0.15: 27.85,45.25 27.8,45.2 | 30.25,45.25 v30.5,45.5
  Top 0.178: 83.51,68.01 U13.11
  Top 0.254: U12.11 83.5,87 | U12.7
  Top 0.305: U1.17 30.05,43.25 30.1,43.3 30.1,43.6 v30.5,44 | 83.5,87 U12.7 83.5,89.5 | U13.7 83.51,68.01 | U1.13 30.25,45.25
  other vias: 32,44 30.5,42.5 32,42.5 33.5,42.5 33.5,44 32,45.5 33.5,45.5 59.71,17.6 38.4,33.8
  pour Bottom (rank 6): -9,110.5 134.5,110 134.5,-2.5 -9.5,-2.5
  pour Top (rank 6): -12.5,113.5 139,113.5 138.5,-6.5 -13,-6.5
  pour Route2 (rank 6): -11.5,112.5 137.5,112.5 137,-5.5 -12,-5.5
HMI_BUTTON_1  (via drill 0.35)
  Top 0.178: R59.1 11.9,70.1 v11.5,70.5 | v6.3,78.8 6.28,78.83 J15.2
  Bottom 0.178: 11.5,72 v11.5,70.5 8,70.5 6.3,72.2 v6.3,78.8
HMI_BUTTON_2  (via drill 0.35)
  Top 0.178: v11.3,72.9 11.9,72.3 R60.1 | v9.9,78.8 9.47,79.22 J15.3
  Bottom 0.178: v11.3,72.9 9.9,74.3 v9.9,78.8
HMI_BUTTON_3  (via drill 0.35)
  Top 0.178: R61.1 v11.65,74.85 | J15.4 6.24,81.36 v6.3,81.3
  Bottom 0.178: v6.3,81.3 10.2,81.3 10.5,81 10.5,76 v11.65,74.85
HMI_BUTTON_4
  Top 0.178: R62.1 11.4,77.1 11.2,77.3 11.2,80.8 10.6,81.4 9.8,81.4 9.47,81.72 J15.5
HMI_BUTTON_5  (via drill 0.35)
  Top 0.178: R63.1 v11.75,79.35 | J15.6 6,83.91 v6.05,83.85
  Bottom 0.178: v6.05,83.85 10.65,83.85 11.5,83 11.5,79.6 v11.75,79.35
HMI_BUTTON_6
  Top 0.178: R64.1 11.9,81.9 11.5,82.3 11.5,85 11.32,85.17 J15.7
HMI_BUTTON_ISO_1  (via drill 0.35)
  Top 0.178: U4.63 52.5,61.5 v50.5,63.5 | v23.5,63.5 23.03,63.97 U9.7
  Bottom 0.178: v50.5,63.5 v23.5,63.5
HMI_BUTTON_ISO_2  (via drill 0.35)
  Top 0.178: U4.62 53,63 v51.5,64.5 | v22,64.5 21.73,64.77 U9.5
  Bottom 0.178: v51.5,64.5 v22,64.5
HMI_BUTTON_ISO_3  (via drill 0.35)
  Top 0.178: v52.5,65.5 53.5,64.5 U4.61 | v25,70.5 25,73 24.5,73.5 23.5,73.5 23,73 23,72.16 U9.2
  Bottom 0.178: v52.5,65.5 26.5,65.5 25.5,66.5 25.3,66.7 25,67 v25,70.5
HMI_BUTTON_ISO_4  (via drill 0.35)
  Top 0.178: U4.60 54,65.5 v52.5,67 | v26.5,68 26.5,73 23.33,76.17 U10.7
  Bottom 0.178: v52.5,67 27.5,67 v26.5,68
HMI_BUTTON_ISO_5  (via drill 0.35)
  Top 0.178: v27.5,69 27.5,73.5 v26,75 | v54,67 54.5,66.5 U4.59 | v22.3,76.2 22.04,76.47 U10.5
  Bottom 0.178: v27.5,69 28.5,68 53,68 v54,67 | v26,75 23.5,75 v22.3,76.2
HMI_BUTTON_ISO_6
  Top 0.178: R15.1 R14.2 36.25,72.25 36,72 32,72 31,73 31,82.5 30.3,83.2 23.7,83.2 23.33,82.83 U10.2
HMI_BUTTON_MCU_FCT_6  (via drill 0.35)
  Top 0.178: R15.2 41.05,72.5 v41,72.5 | v55,68 U4.58
  Bottom 0.178: v55,68 55,71.5 54,72.5 v41,72.5
HMI_LCD_BACKLIGHT  (via drill 0.35)
  Top 0.178: v44.5,84 23.5,84 22.15,85.35 R66.2 | v56,67 U4.56
  Bottom 0.178: v56,67 56,73.9 55,74.9 45,74.9 44.5,75.4 v44.5,84
HMI_LCD_LED+
  Top 0.178: T2.3 14.6,85.1 14.25,85.45 R65.2 14.25,88.05 14.96,88.75 J14.1
HMI_LCD_SCL  (via drill 0.35)
  Top 0.178: J14.6 21.3,96.19 22.5,95 30,95 31.15,93.85 R57.2 31.15,86.65 30.4,85.9 v28.9,85.9 U11.3 | U4.49 61.5,55.5 62,56 v62,57
  Bottom 0.178: v62,57 62,59.5 59.5,62 59.5,73.5 57.3,75.7 46.7,75.7 45.7,76.7 45.7,84.3 45,85 29.8,85 v28.9,85.9
HMI_LCD_SDA  (via drill 0.35)
  Top 0.178: 27.2,88.15 U11.4 v28.6,88.1 29.35,88.85 R58.2 29.35,92.65 28,94 21,94 20,93 20,91.06 20.04,91.03 J14.5 | U4.48 62.3,55 v62.8,55.5
  Bottom 0.178: v62.8,55.5 62.8,60.2 60.5,62.5 60.5,74.5 58.5,76.5 47.5,76.5 46.5,77.5 46.5,85.5 46,86 30.7,86 v28.6,88.1
HMI_LCD_VO
  Top 0.178: J14.7 22.57,89.92 23,89.5 26,89.5 26.5,89 U11.5
HMI_LED_1  (via drill 0.35)
  Top 0.178: U4.73 47.5,58.5 v46.5,59.5 | R55.1 16.9,56.4 v20,59.5
  Bottom 0.178: v46.5,59.5 v20,59.5
HMI_LED_2  (via drill 0.35)
  Top 0.178: U4.70 49,59 v47.5,60.5 | v18,60.5 16.5,59 R53.2
  Bottom 0.178: v47.5,60.5 v18,60.5
HMI_LED_3  (via drill 0.35)
  Top 0.178: U4.69 49.5,60.5 v48.5,61.5 | v17,61.5 R56.1
  Bottom 0.178: v48.5,61.5 v17,61.5
HMI_LED_4  (via drill 0.35)
  Top 0.178: U4.68 50,62 v49.5,62.5 | v17,63.5 16.5,64 R54.2
  Bottom 0.178: v49.5,62.5 18,62.5 v17,63.5
ISP_RXDO  (via drill 0.35)
  Top 0.178: J18.4 15.77,25.27 15,24.5 15,19.2 14,18.2 7.9,18.2 6.64,19.46 J20.3 | U4.99 43.5,44.5 43,44 43,29 v39.5,25.5
  Bottom 0.178: v39.5,25.5 39.27,25.27 J18.4
ISP_TXDO  (via drill 0.35)
  Top 0.178: J18.5 15.31,27.81 14,26.5 14,20.5 12.96,19.46 J20.4 | U4.98 42.7,45 42.2,44.5 42.2,30.2 v39.8,27.8
  Bottom 0.178: J18.5 v39.81,27.81 v39.8,27.8
JTAG_TCK  (via drill 0.35)
  Top 0.178: U4.5 48.5,39.1 46.9,37.5 v46.9,36.9 | v22.1,30.1 21,29 14,29 13,28 13,25.5 12.04,24.54 J20.8
  Bottom 0.178: v46.9,36.9 46.9,31.2 45.8,30.1 v22.1,30.1
JTAG_TDI  (via drill 0.35)
  Top 0.178: U4.2 47,41.2 44.5,38.7 v44.5,32.8 | v40.3,32.2 28.5,32.2 27.5,33.2 11,33.2 9.7,31.9 9.7,28.8 9.4,28.5 7.5,28.5 6.9,27.9 6.9,26.2 6.5,25.8 5,25.8 4.5,25.3 J20.7
  Bottom 0.178: v40.3,32.2 43.9,32.2 v44.5,32.8
JTAG_TDO  (via drill 0.35)
  Top 0.178: v43.7,33.8 43.7,39.1 46.5,41.9 U4.1 | v31,33 29,33 28,34 9.5,34 8.8,33.3 8.8,30.1 7.9,29.2 5.2,29.2 4.5,28.5 J20.9
  Bottom 0.178: v31,33 42.9,33 v43.7,33.8
JTAG_TMS  (via drill 0.35)
  Top 0.178: v45.3,34.8 45.3,38.3 47.5,40.5 U4.3 | v39,31.5 27.5,31.5 26.5,32.5 12,32.5 11.5,32 11.5,27.5 11.08,27.08 J20.10
  Bottom 0.178: v39,31.5 45,31.5 45.3,31.8 v45.3,34.8
L1_1  (via drill 0.35)
  Top 0.178: U1.22 30.25,34.25 v29.85,33.85
  Bottom 0.178: v29.85,33.85 29,33 9.5,33 7.5,35 4,35 3.6,35.4 J2.L2
L1_2  (via drill 0.35)
  Top 0.178: U1.21 29.75,35.25 v29.65,35.15
  Bottom 0.178: v29.65,35.15 28.5,34 10,34 8,36 4.9,36 4.1,36.8 4.1,38.6 5,39.5 5,40.5 3.6,41.9 J2.L4
LED_DEBUG
  Top 0.178: U4.76 43,56 42.5,56.5 42.5,68.5 43,69 45.95,69 R20.2
MII_MODE  (via drill 0.35)
  Top 0.178: U1.32 37.25,42.25 v37.4,42.1
  Bottom 0.178: v37.4,42.1 37.65,41.85 R10.2
N$1  (via drill 0.35)
  Top 0.178: v11.5,59 R53.1 | J16.3 11.13,67.06 11.5,66.7 v11.5,65.8
  Bottom 0.178: v11.5,65.8 v11.5,59
N$2
  Top 0.178: R54.1 12.65,67.85 12,68.5 10,68.5 9.5,69 9.5,69.58 J16.5
N$3  (via drill 0.35)
  Top 0.15: R8.1 49.15,83.65 v49,83.5 | C5.1 56,83 v55.5,83.5 53.65,83.5 R7.2
  Bottom 0.15: v49,83.5 v55.5,83.5
N$4
  Top 0.178: R9.1 28.35,39.85 29.05,40.55 U1.20
N$5
  Top 0.254: U12.5 83.99,83.5 R67.2
  pour Top (rank 4): 85,86 85.36,86 86.5,84.86 86.5,82 83.7,82 83.7,86
N$6
  pour Top (rank 2): 86.5,82 86.5,80 83.3,80 83.3,86 83.8,86 83.8,82
N$8
  Bottom 0.178: J2.L1 5.78,37.67 6.2,38.1 6.2,41.05 R1.1
N$9
  Bottom 0.178: J2.L3 5.12,46.38 5.4,46.1 R2.1
N$10
  Top 0.178: R68.2 83.99,64.5 U13.5
  pour Top (rank 4): 86.5,63.4 86.5,65.36 85.36,66.5 83.8,66.5 83.8,63.4
N$11
  Top 0.178: J9.2 86.3,5.03 R41.1
N$12
  Top 0.178: R43.2 R46.1 J11.3
N$13
  Top 0.178: J10.2 73.8,5.03 R42.1
N$14
  Top 0.178: R44.2 R47.1 53.91,5.02 J11.5
N$15
  Top 0.178: J19.2 31.7,5.3 31,6 R78.1 R81.2
N$16
  Top 0.178: J19.3 32.35,5.45 32.9,6 R79.1 R80.2
N$17
  Top 0.178: R59.2 C37.1 16.35,69.15 16.5,69 20,69 20.5,69.5 20.5,70.4 21,70.9 23.4,70.9 23.66,71.17 U9.1
N$18
  Top 0.178: R77.1 LED10.C
N$19
  Top 0.178: R60.2 C39.1 16.35,73.35 16.5,73.5 22,73.5 22.37,73.13 U9.3
N$20  (via drill 0.35)
  Top 0.178: R61.2 C41.1 16.35,75.85 16.5,76 21,76 v22.5,74.5 | v22.5,69.9 22.37,69.77 U9.6
  Bottom 0.178: v22.5,74.5 v22.5,69.9
N$21
  Top 0.305: R21.1 J4.2
N$22
  pour Top (rank 2): 86.5,61 86.5,63.2 83.8,63.2 83.8,66.5 83.3,66.5 83.3,61
N$23
  Top 0.305: R22.1 J5.2
N$24
  Top 0.305: R21.2 88.6,22.5 87.8,23.3 K1.1
N$25  (via drill 0.35)
  Top 0.178: R62.2 C38.1 16.35,77.85 16.5,78 v21,78 | v24,80 23.96,80.03 U10.1
  Bottom 0.178: v21,78 23.5,78 24,78.5 v24,80
N$26
  Top 0.178: R63.2 C40.1 16.35,80.35 16.5,80.5 22.3,80.5 22.67,80.87 U10.3
N$27  (via drill 0.35)
  Top 0.178: R64.2 C42.1 16.35,82.85 16.5,83 19.5,83 v20,82.5 | v20,79.5 22.5,79.5 22.67,79.33 U10.6
  Bottom 0.178: v20,82.5 v20,79.5
N$28
  Top 0.406: K3.1 87.8,44.7 89,43.5 R23.2
N$29
  Top 0.178: K1.6 82.4,21.6 80.2,23.8 K1.4
N$30
  Top 0.254: U12.3 83,79.5
  pour Top (rank 3): 86.5,80 86.5,77.5 81,77.5 81,80.5 82.7,80.5 82.7,86 83.3,86 83.4,85.3 83.4,79.9
N$31
  Top 0.254: U12.8 83,96 C50.1
  pour Top (rank 2): 78,97.5 81.96,97.5 83.1,96.36 83.1,88 82.7,88 82.7,94.5 78,94.5
N$32
  Top 0.406: R23.1 J6.2
N$33
  Top 0.406: K4.1 87.8,55.2 89,54 R24.2
N$34
  pour Top (rank 5): 68.75,87 78,87 78,88 82.2,88 82.2,90.5 78,90.5 78,97.5 70.14,97.5 68.75,96.36
N$35
  pour Top: 78,94.5 82.8,94.5 82.8,88 82.4,88 82.4,90.5 78,90.5
N$36
  Top 0.178: U13.3 83,60
  pour Top (rank 3): 80,58.5 86.5,58.5 86.5,60.5 83.3,60.5 83.3,66.5 82.8,66.5 82.8,60.5 80,60.5
N$37
  Top 0.406: R24.1 J7.2
N$38
  Top 0.178: R34.2 C29.1 72.35,29.65 72.69,29.3 U6.3
N$39
  Top 0.178: R33.2 C28.1 72.35,22.35 72.69,22.7 U6.1
N$40
  Top 0.178: U13.8 83,75.5
  pour Top (rank 2): 78,77 78,75 82.8,75 82.8,68.7 82.8,68.5 83.2,68.5 83.3,68.5 83.3,71.2 83.3,75.86 82.16,77
N$41
  Top 0.178: R37.2 C30.1 72.5,41.15 72.5,43.5 72.8,43.8 U7.1
N$42
  Top 0.178: R40.2 C31.1 72.5,51.35 72.5,49.5 72.8,49.2 U7.3
N$43
  pour Top (rank 5): 78,77 74.08,77 68.75,71.67 68.75,67 77,67 77,68.4 82.3,68.4 82.3,71.1 78,71.1
N$44
  Top 0.406: R70.1 LED7.A
N$45
  Top 0.15: 89,72 88.2,72.8 88.2,74.45 LED6.C
  Top 0.406: R69.1 89,72
N$46
  pour Top: 78,74.7 78,71 82.3,71 82.3,68.5 82.8,68.5 82.8,74.7
N$47
  Top 0.178: U3.7 52.37,26.14 52.5,26 59.5,26 | 59.5,26 60,26 60.3,26.3 R11.1 | TP3.TP 60,25.5 59.5,26
N$48
  Top 0.178: R17.1 60.15,74 | 60.15,74 R19.2 R18.2 | 60.15,74 59.5,74.65 SW2.3 SW2.4
N$49
  Top 0.178: R20.1 LED1.C
N$50
  Top 0.178: R76.1 LED9.A
N$51
  Top 0.178: R75.1 LED8.A
N$52
  Top 0.178: J11.2 61.51,5.04 R48.1 R45.2
N$53
  Top 0.178: U8.6 59.74,14.97 60.41,14.3 61.21,14.3 61.51,14 R48.2
N$54
  Top 0.178: R47.2 53.91,12.9 55.01,14 59.41,14 59.74,13.67 U8.3
N$55
  Top 0.305: R22.2 88.6,33 87.8,33.8 K2.1
N$57
  Top 0.178: K2.6 82.4,32.1 80.2,34.3 K2.4
N$58
  Top 0.178: R28.2 R33.1 76.1,19.75 LED2.C 77.6,19.65 K1.5
N$59
  Top 0.178: K4.6 82.4,52.6 80.2,54.8 K4.4
N$60
  Top 0.178: K3.6 82.4,42.6 80.2,44.8 K3.4
N$61
  Top 0.178: R46.2 59.01,10.3 58.41,10.9 58.41,12.44 U8.1
N$62
  Top 0.178: R25.1 46.8,5.24 J8.2
N$63  (via drill 0.35)
  Top 0.178: R55.2 v10.1,56.4 | v6.3,65.8 v6.29,65.8 J16.2
  Bottom 0.178: v6.3,65.8 7.7,65.8 9.8,63.7 9.8,56.7 v10.1,56.4
N$64  (via drill 0.35)
  Top 0.178: R56.2 v10.5,61.5 | v6.3,68.3 6.26,68.33 J16.4
  Bottom 0.178: v10.5,61.5 10.5,67.5 9.7,68.3 v6.3,68.3
N$65
  Top 0.178: J12.2 12.23,7.92 R49.2 R51.2
N$66
  Top 0.178: J13.2 19.23,7.92 R50.1 R52.1
N$67
  Top 0.178: T2.1 17.89,87.05 R66.1
N$70
  Top 0.178: LED2.A R35.1
N$71
  Top 0.178: K2.5 77.6,30.15 LED3.C 76.1,30.25 R29.2 R34.1
N$72
  Top 0.178: LED3.A R36.1
N$73
  Top 0.178: R31.2 R37.1 76.1,40.75 LED4.C 77.6,40.65 K3.5
N$74
  Top 0.15: LED4.A R38.1
N$75
  Top 0.178: 77.6,51.15 LED5.C | R32.2 R40.1 76.1,51.25 LED5.C | K4.5 78.85,50.65 78.25,51.25 LED5.C
N$76
  Top 0.178: LED5.A R39.1
N$78
  Top 0.178: R26.1 44.2,5.3 J8.3
N$79
  Top 0.178: U5.3 44.05,13.95 45,13 45,11.5 45.5,11 46.5,11 46.8,10.7 R25.2 R27.2
N$80
  Top 0.178: R30.2 42.65,12.2 U5.4 44.05,9.9 R26.2
PFBOUT  (via drill 0.5, 0.6)
  Top 0.305: U1.19 28.55,42.25 28,41.7 v28,40.9 | U1.16 28.25,43.75 v28.1,43.6 | U1.30 34.25,40.25 v34.5,40
  Bottom 0.305: C8.1 27.35,44.25 27.45,44.25 v28.1,43.6 | C6.1 28,40.55 v28,40.9 | C7.1 35.15,39.35 v34.5,40 | C4.+ v36,40.7
  Bottom 0.406: 28,41.05 v28,40.9
  pour Route15: 29,45 27,45 27,43.8 28.3,42.5 28.3,41.9 27.5,41.1 27.5,40.5 33.5,40.5 35,39 36.5,39 37,39.5 37,41.5 30,41.5 29,42.5
RTCX1
  Top 0.178: U4.16 54,40.5 52,38.5 51.3,38.5 50.25,37.45 X2.1 50.2,36.55 C19.1
RTCX2
  Top 0.178: U4.18 55,39.2 54.3,38.5 53.5,38.5 52.75,37.75 X2.2 52.8,36.55 C24.1
USB_D_N  (via drill 0.35)
  Top 0.178: U4.30 63.6,46 64.5,45.1 64.5,20.5 64,20 v33.5,20 | v31,19.5 R78.2
  Bottom 0.178: v33.5,20 31.5,20 v31,19.5
USB_D_P
  Top 0.178: U4.29 63.5,45.5 64,45 64,21.5 63.5,21 33,21 32.1,20.1 32.1,10.1 32.9,9.3 R79.2
USB_UP_LED  (via drill 0.35)
  Top 0.178: U4.32 v64,47 | R77.2 62.55,68.95 64,67.5 v64,56
  Bottom 0.178: v64,47 v64,56
USB_V_BUS  (via drill 0.5)
  Top 0.305: U4.21 56.5,44 v57,44.5 | J19.1 31.05,4.95 30.5,5.5 v28.5,5.5
  Route15 0.406: v28.5,5.5 36.5,5.5 38,7 38,14.5 39.5,16 53.5,16 56.5,19 61.5,19 62.5,20 62.5,34 57,39.5 v57,44.5
VBAT+  (via drill 0.5)
  Top 0.305: U4.19 v55.5,45
  Bottom 0.406: v11,13.5 11,11.5 9.5,10 X4.+2 | 10.6,30.47 v10.6,30.87 10.6,27.1 9.37,25.87 X4.+1
  pour Route15: 9.5,32 9.5,12 12.5,12 12.5,29 45.5,29 48,31.5 48,44 50,46 55,46 55,44.5 56,44.5 56,46 55.5,46.5 49.5,46.5 47.5,44.5 47.5,31.5 45.5,29.5 12.5,29.5 12.5,31.5 12,32
VIN
  pour Top: 90,85 90,76.5 87.5,76.5 87.5,73 97,73 97,85
XTAL1
  Top 0.178: X3.3 56.27,37.77 57,38.5 U4.22

## Text on the board
Top: 1
Route2: 2
Route15: 3
Bottom: 4
tPlace: HMI LCD | CANOPEN BUS | HMI BUTTON | RESET | BOOT | FUSE | HMI LED | DRIVE ERROR | DRIVE ENABLE | ISP_TX | BRAKE SENSOR 2 | ISP_RX | WDY Main Board / Rev A2 | GND | BRAKE SENSOR 1 | +5V | +3V3 | +24V | TEMP_2 | TEMP_1 | SLACK | ENCODER | FAN 2 | FAN 1